# Altium schematic sheet Power_InrushLimit.SchDoc: Inrush Current Limiter
size Letter; Engineer: Nathan Petersen; DocumentNumber: 24; SheetNumber: 24; SheetTotal: 26
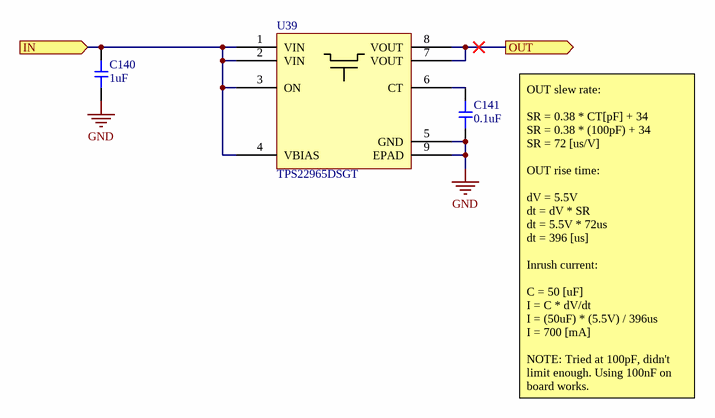
[diagram p0: Power_InrushLimit.SchDoc]

## Parts
C140  value 1uF  [0603-CAP]  (hidden comment: Capacitor)
C141  value 0.1uF  [0603-CAP]  (hidden comment: Capacitor)
U39  TPS22965DSGT  [SON50P200X80_HS-9N]

## Ports
IN (in), OUT (out)

## Nets
GND: C140.1 C141.1 U39.5(GND) U39.9(EPAD)
IN: C140.2 U39.1(VIN) U39.2(VIN) U39.3(ON) U39.4(VBIAS) ; port IN
OUT: U39.7(VOUT) U39.8(VOUT) ; port OUT
NetC141_2: C141.2 U39.6(CT)

## Notes on the sheet
- OUT slew rate:
  SR = 0.38 * CT[pF] + 34
  SR = 0.38 * (100pF) + 34
  SR = 72 [us/V]
  OUT rise time:
  dV = 5.5V
  dt = dV * SR
  dt = 5.5V * 72us
  dt = 396 [us]
  Inrush current:
  C = 50 [uF]
  I = C * dV/dt
  I = (50uF) * (5.5V) / 396us
  I = 700 [mA]
  NOTE: Tried at 100pF, didn't limit enough. Using 100nF on board works.
- Title:
- File:
- Sheet:
- of
- Revision:
- Time:
- Date:
- Engineer:

## Library data of the parts
U39 = TPS22965DSGT: IC LOAD SWITCH 6A 8WSON; Supplier 1: Digi-Key; Supplier Part Number 1: 296-34943-1-ND
C140 C141 = Capacitor: Supplier 1: Digi-Key
  C140: Supplier Part Number 1: 1276-6524-1-ND
  C141: Supplier Part Number 1: 1276-1012-1-ND